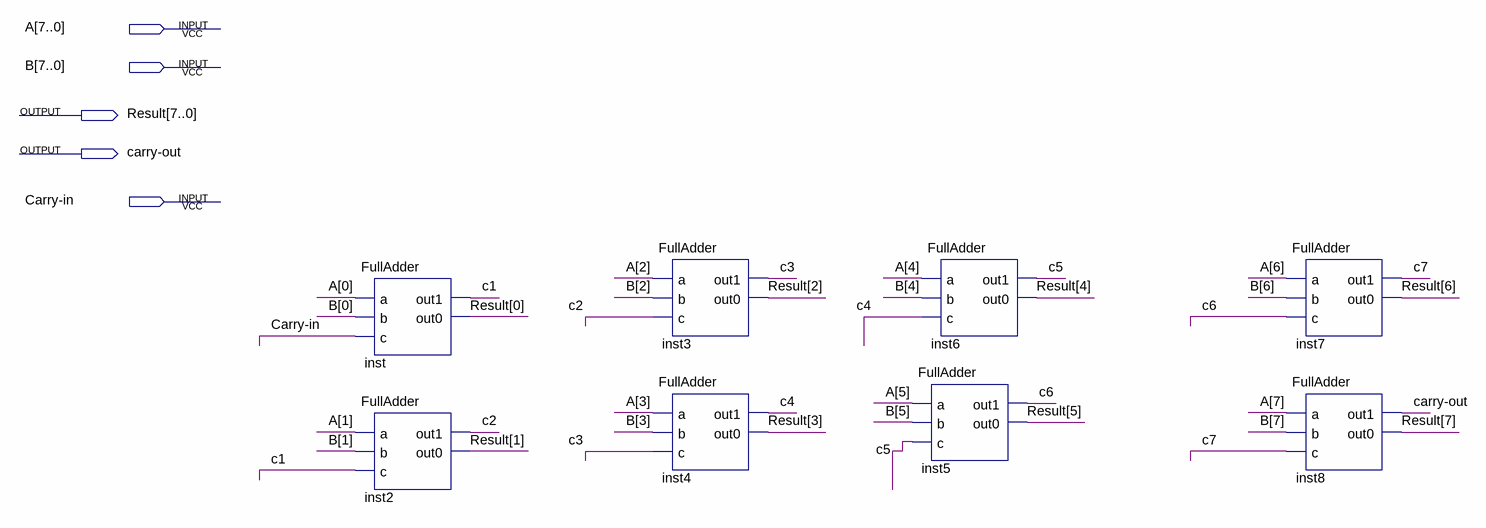
[diagram p0: schematic sheet]
// Quartus schematic adder8bit.bdf as structural Verilog: 8 symbols, 5 pins
module adder8bit (
  input  [7:0] A,
  input  [7:0] B,
  input  \Carry-in ,
  output [7:0] Result,
  output \carry-out 
);

  wire c1, c2, c3, c4, c5, c6, c7;

  FullAdder inst (.a(A[0]), .b(B[0]), .c(\Carry-in ), .out1(c1), .out0(Result[0]));
  FullAdder inst2 (.a(A[1]), .b(B[1]), .c(c1), .out1(c2), .out0(Result[1]));
  FullAdder inst3 (.a(A[2]), .b(B[2]), .c(c2), .out1(c3), .out0(Result[2]));
  FullAdder inst4 (.a(A[3]), .b(B[3]), .c(c3), .out1(c4), .out0(Result[3]));
  FullAdder inst6 (.a(A[4]), .b(B[4]), .c(c4), .out1(c5), .out0(Result[4]));
  FullAdder inst5 (.a(A[5]), .b(B[5]), .c(c5), .out1(c6), .out0(Result[5]));
  FullAdder inst7 (.a(A[6]), .b(B[6]), .c(c6), .out1(c7), .out0(Result[6]));
  FullAdder inst8 (.a(A[7]), .b(B[7]), .c(c7), .out1(\carry-out ), .out0(Result[7]));
endmodule
